# Altium project I2C_motorDriver.PrjPcb
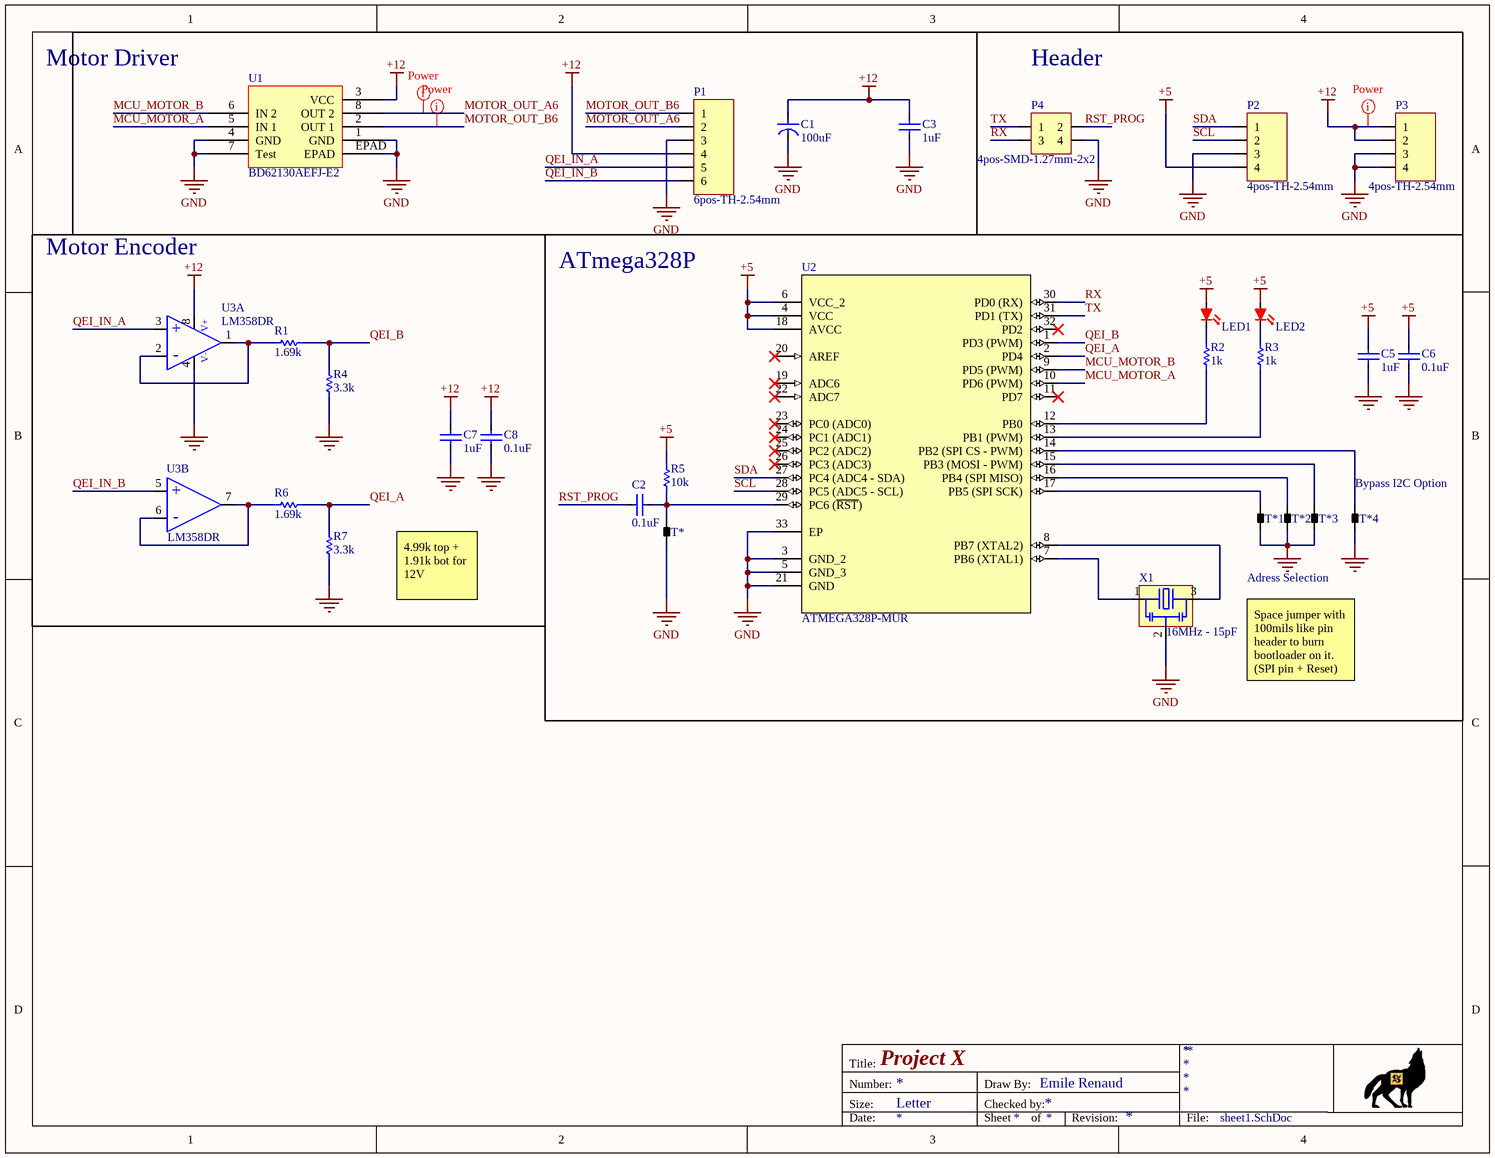
[diagram p0: sheet1.SchDoc]
1 sheet, 29 parts. Net scope: global (net labels, ports and power ports of the same name join across sheets).
Board file: I2C_motorDriver.PcbDoc

## Sheet sheet1.SchDoc: Project X
size Letter; DrawnBy: Emile Renaud

### Parts
C1  value 100uF  [CAPACITOR-Aluminium-5x11mm-2mmPitch]  (hidden comment: CAP ALUM 100UF 20% 25V RADIAL)
C2  value 0.1uF  [CAPACITOR-0603]  (hidden comment: Capacitor-0603-0.1uF-50V-X7R)
C3  value 1uF  [CAPACITOR-0603]  (hidden comment: Capacitor-0603-1uF-25V-X5R)
C5  value 1uF  [CAPACITOR-0603]  (hidden comment: Capacitor-0603-1uF-25V-X5R)
C6  value 0.1uF  [CAPACITOR-0603]  (hidden comment: Capacitor-0603-0.1uF-50V-X7R)
C7  value 1uF  [CAPACITOR-0603]  (hidden comment: Capacitor-0603-1uF-25V-X5R)
C8  value 0.1uF  [CAPACITOR-0603]  (hidden comment: Capacitor-0603-0.1uF-50V-X7R)
LED1  B1911USD-20D000114U1930  [LED-0603-2PIN]  (value not drawn)
LED2  B1911USD-20D000114U1930  [LED-0603-2PIN]  (value not drawn)
P1  6pos-TH-2.54mm  [HDR1X6]
P2  4pos-TH-2.54mm  [HDR1X4]
P3  4pos-TH-2.54mm  [HDR1X4]
P4  4pos-SMD-1.27mm-2x2  [HDR2X2-SMD-50mils]
R1  value 1.69k  [Resistor-0603]  (hidden comment: SMT resistor)
R2  value 1k  [Resistor-0603]  (hidden comment: SMT resistor)
R3  value 1k  [Resistor-0603]  (hidden comment: SMT resistor)
R4  value 3.3k  [Resistor-0603]  (hidden comment: SMT resistor)
R5  value 10k  [Resistor-0603]  (hidden comment: SMT resistor)
R6  value 1.69k  [Resistor-0603]  (hidden comment: SMT resistor)
R7  value 3.3k  [Resistor-0603]  (hidden comment: SMT resistor)
T*  NetTie_0603_Short  [NetTie-0603-short]  (value not drawn)
T*1  NetTie_0603_Short  [NetTie-0603-short]  (value not drawn)
T*2  NetTie_0603_Short  [NetTie-0603-short]  (value not drawn)
T*3  NetTie_0603_Short  [NetTie-0603-short]  (value not drawn)
T*4  NetTie_0603_Short  [NetTie-0603-short]  (value not drawn)
U1  BD62130AEFJ-E2  [P-HSOP8]
U2  ATMEGA328P-MUR  [VFQFN-32 Exposed Pad]
U3  LM358DR  [SOIC-8]  (parts A,B of 2)
X1  value 16MHz - 15pF  [Resonator-CSTNE]  (hidden comment: CSTNE16M0V530000R0)

### Blocks framed on the sheet
Motor Encoder: C7 C8 R1 R4 R6 R7 U3

### Nets
+5: C5.2 C6.2 LED1.2(R) LED2.2(R) P2.4 R5.2 U2.4(VCC) U2.6(VCC_2) U2.18(AVCC)
+12: C1.1 C3.2 C7.2 C8.2 P1.4 P3.1 P3.2 U1.3(VCC) U3.8(VS+)
GND: C1.2 C3.1 C5.1 C6.1 C7.1 C8.1 P1.3 P2.3 P3.3 P3.4 P4.4 R4.1 R7.1 T*.2 T*1.2 T*2.2 T*3.2 T*4.2 U1.1(GND) U1.4(GND) U1.7(Test) U1.EPAD U2.3(GND_2) U2.5(GND_3) U2.21(GND) U2.33(EP) U3.4(VS-) X1.2
MCU_MOTOR_A: U1.5(IN_1) U2.10(PD6_(PWM))
MCU_MOTOR_B: U1.6(IN_2) U2.9(PD5_(PWM))
MOTOR_OUT_A6: P1.2 U1.8(OUT_2)
MOTOR_OUT_B6: P1.1 U1.2(OUT_1)
QEI_A: R6.2 R7.2 U2.2(PD4)
QEI_B: R1.2 R4.2 U2.1(PD3_(PWM))
QEI_IN_A: P1.5 U3.3(IN1+)
QEI_IN_B: P1.6 U3.5(IN2+)
RST_PROG: C2.1 P4.2
RX: P4.3 U2.30(PD0_(RX))
SCL: P2.2 U2.28(PC5_(ADC5_-_SCL))
SDA: P2.1 U2.27(PC4_(ADC4_-_SDA))
TX: P4.1 U2.31(PD1_(TX))
NetC2_2: C2.2 R5.1 T*.1 U2.29(PC6_(~{RST}))
NetLED1_1: LED1.1(K) R2.2
NetLED2_1: LED2.1(K) R3.2
NetR1_1: R1.1 U3.1(OUT1) U3.2(IN1-)
NetR2_1: R2.1 U2.12(PB0)
NetR3_1: R3.1 U2.13(PB1_(PWM))
NetR6_1: R6.1 U3.6(IN2-) U3.7(OUT)
NetT*1_1: T*1.1 U2.17(PB5_(SPI_SCK))
NetT*2_1: T*2.1 U2.16(PB4_(SPI_MISO))
NetT*3_1: T*3.1 U2.15(PB3_(MOSI_-_PWM))
NetT*4_1: T*4.1 U2.14(PB2_(SPI_CS_-_PWM))
NetU2_7: U2.7(PB6_(XTAL1)) X1.1
NetU2_8: U2.8(PB7_(XTAL2)) X1.3

Not connected (* = marked no-connect by the designer): U2 11(PD7)* 19(ADC6)* 20(AREF)* 22(ADC7)* 23(PC0_(ADC0))* 24(PC1_(ADC1))* 25(PC2_(ADC2))* 26(PC3_(ADC3))* 32(PD2)*

### Layout directives
net class Power: +12, MOTOR_OUT_A6, MOTOR_OUT_B6

### Notes on the sheet
- Motor Driver
- Header
- ATmega328P
- (near T*4) Bypass I2C Option
- 4.99k top + 1.91k bot for 12V
- Adress Selection
- Space jumper with 100mils like pin header to burn bootloader on it. (SPI pin + Reset)
- Title:
- Size:
- Number:
- Letter
- Draw By:
- Checked by:
- Date:
- Sheet
- of
- Revision:
- File:
- (in symbol LM358DR, part A) V+; +; -; V-
- (in symbol LM358DR, part B) +; -

### Library data of the parts
C1 = Capacitor-100uF-25V: Volt: 25V; Precision: 20%; Mounted: Yes; Supplier 1: Digi-Key; Supplier Part Number 1: 399-6102-ND; Supplier 2: Digi-Key; Supplier 3: Digi-Key; Supplier 4: Digi-Key
C2 C6 C8 = Capacitor-0603-0.1uF-50V-X7R: Precision: X7R-10%; Volt: 50V; Package / Case: Metric 1608, EIA 0603; Mounted: Yes; Supplier 1: Digi-Key; Supplier Part Number 1: 1276-1935-2-ND; Supplier 2: Digi-Key; Supplier 3: Digi-Key; Supplier 4: Digi-Key; Supplier Part Number 2: 1276-1934-2-ND
C3 C5 C7 = Capacitor-0603-1uF-25V-X5R: Precision: X5R-10%; Volt: 25V; Package / Case: Metric 1608, EIA 0603; Mounted: Yes; Supplier 1: Digi-Key; Supplier Part Number 1: 1276-1859-2-ND; Supplier 2: Digi-Key; Supplier 3: Digi-Key; Supplier 4: Digi-Key; Supplier Part Number 2: 1276-1942-2-ND
LED1 LED2 = B1911USD-20D000114U1930: LED RED CLEAR 1608 SMD; Package / Case: 0603 (1608 Metric); Mounted: Yes; Supplier 1: Digi-Key; Supplier Part Number 1: 3147-B1911USD-20D000114U1930CT-ND
P1 = 6pos-TH-2.54mm: 6pos TH 2.54mm Header; Supplier 1: Digi-Key; Supplier Part Number 1: N/A; Mounted: Yes; Package / Case: TH; Volt: N/A
P2 P3 = 4pos-TH-2.54mm: 4pos TH 2.54mm Header; Supplier 1: Digi-Key; Supplier Part Number 1: N/A; Mounted: Yes; Package / Case: TH; Volt: N/A
P4 = 4pos-SMD-1.27mm-2x2: 4pos SMD 1.27mm; Supplier 1: Digi-Key; Supplier Part Number 1: S9012E-02-ND; Mounted: Yes; Package / Case: TH; Volt: N/A
R1 R6 = Resistor0603-1.69k: Precision: 1%; Watt: 0.25W; Mounted: Yes; Package / Case: Metric 1608, EIA 0603; Supplier 2: Digi-Key; Supplier 4: Digi-Key; Supplier 1: Digi-Key; Supplier 3: Digi-Key; Supplier Part Number 1: RMCF0603FT1K69CT-ND
R2 R3 = Resistor0603-1k: Precision: 1%; Watt: 0.1W; Mounted: Yes; Package / Case: Metric 1608, EIA 0603; Supplier 2: Digi-Key; Supplier 4: Digi-Key; Supplier Part Number 2: 311-1.00KHRTR-ND; Supplier 1: Digi-Key; Supplier 3: Digi-Key; Supplier Part Number 1: RMCF0603FT1K00TR-ND; Supplier Part Number 3: AG1307TR-ND
R4 R7 = Resistor0603-3.3k: Precision: 5%; Watt: 0.25W; Mounted: Yes; Package / Case: Metric 1608, EIA 0603; Supplier 2: Digi-Key; Supplier 4: Digi-Key; Supplier 1: Digi-Key; Supplier 3: Digi-Key; Supplier Part Number 1: 311-3.30KHRCT-ND
R5 = Resistor0603-10k: Precision: 1%; Watt: 0.1W; Mounted: Yes; Package / Case: Metric 1608, EIA 0603; Supplier 2: Digi-Key; Supplier 4: Digi-Key; Supplier Part Number 2: RMCF0603FT10K0TR-ND; Supplier 1: Digi-Key; Supplier 3: Digi-Key; Supplier Part Number 1: 311-10.0KHRTR-ND
U1 = BD62130AEFJ-E2: 1 CHANNEL H BRIDGE Motor. 28V, 3A; Supplier 1: Digi-Key; Supplier Part Number 1: BD62130AEFJ-E2CT-ND; Package / Case: 8-HTSOP-J; Mounted: Yes
U2 = ATMEGA328P-MUR: AVR AVR® ATmega Microcontroller IC 8-Bit 20MHz 32KB (16K x 16) FLASH 32-VQFN (5x5); Supplier 1: Digikey; Supplier Part Number 1: ATMEGA328P-MURTR-ND; RefDes: RefDes; Type: Type; HelpURL: https://ww1.microchip.com/downloads/en/DeviceDoc/ATmega48A-PA-88A-PA-168A-PA-328-P-DS-DS40002061B.pdf
U3 = LM358DR: IC OPAMP GP 2 CIRCUIT 8SOIC; Grade: None; Package / Case: SOIC-8; Mounted: Yes; helpURL: https://www.digikey.ca/en/products/detail/texas-instruments/LM358DR/276658?s=N4IgTCBcDa4JwDYC0BGADCgLEsSByAIiALoC%2BQA; Supplier 1: Digi-Key; Supplier Part Number 1: 296-1014-2-ND
X1 = CSTNE16M0V530000R0: CERAMIC RES 16.0000MHZ 15PF SMD; Precision: ±0.20%; Mounted: Yes; Supplier 1: Digi-Key; Supplier Part Number 1: 490-17948-2-ND; Package / Case: 3-SMD 3.20mm x 1.30mm